# EAGLE design M_B_adapter-tssop (EAGLE 9.6.2)
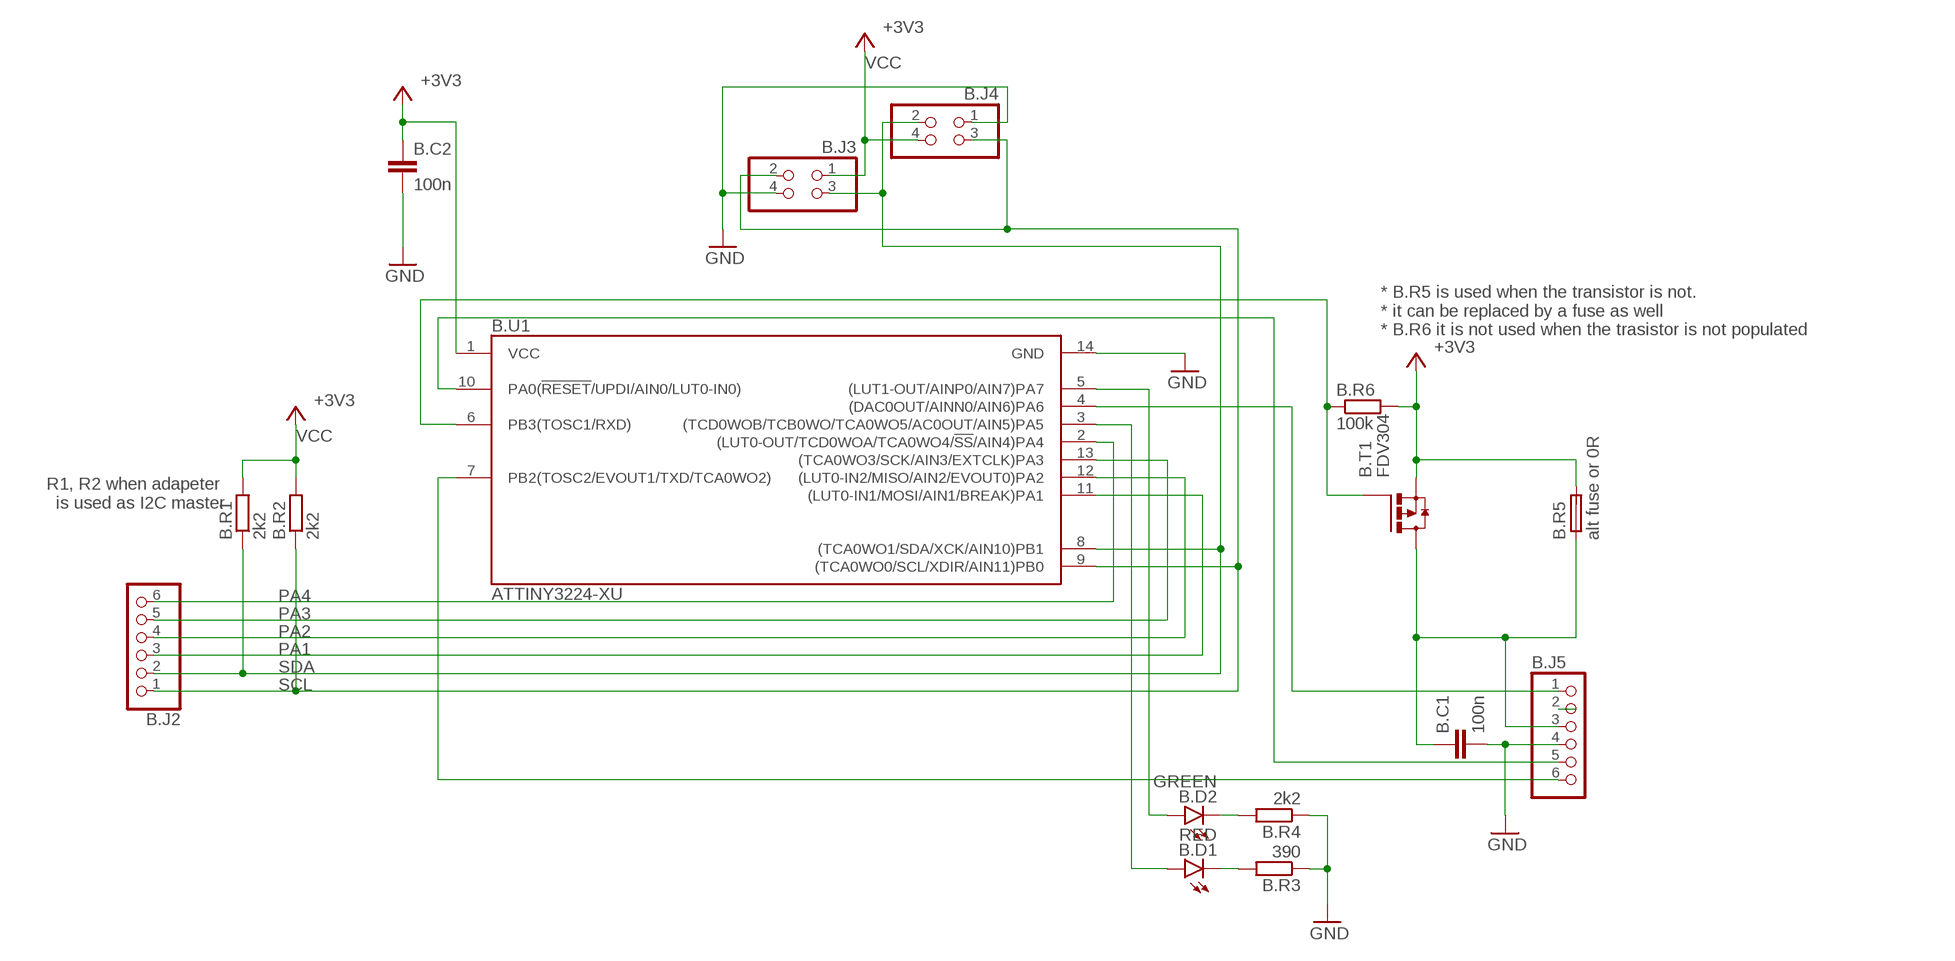
[diagram p0: schematic, sheet 1]

## Parts
B.C1  100n  C-EUC0603  [C0603]
B.C2  100n  C-EUC0603  [C0603]
B.D1  RED  LEDCHIP-LED0603  [CHIP-LED0603]
B.D2  GREEN  LEDCHIP-LED0603  [CHIP-LED0603]
B.J2  PINHD-1X6  [1X06]
B.J3  PINHD-2X2  [2X02]
B.J4  PINHD-2X2  [2X02]
B.J5  PINHD-1X6  [1X06]
B.R1  2k2  R-EU_R0603  [R0603]
B.R2  2k2  R-EU_R0603  [R0603]
B.R3  390  R-EU_R0603  [R0603]
B.R4  2k2  R-EU_R0603  [R0603]
B.R5  alt fuse or 0R  FUSE  [FUSE]
B.R6  100k  R-EU_R0603  [R0603]
B.T1  FDV304  P-MOSFET  [SO23]
B.U1  ATTINY3224-XU  [TSSOP14]

## Nets
GND: B.C1.2 B.C2.2 B.J3.4 B.J4.1 B.J5.4 B.R3.1 B.R4.1 B.U1.14(GND)
N$1: B.D2.C1(C) B.R4.2
N$2: B.D1.C1(C) B.R3.2
N$3: B.C1.1 B.J5.3 B.R5.1 B.T1.D
N$5: B.D1.A1(A) B.U1.3((TCD0WOB/TCB0WO/TCA0WO5/AC0OUT/AIN5)PA5)
PA1: B.J2.3 B.U1.11((LUT0-IN1/MOSI/AIN1/BREAK)PA1)
PA2: B.J2.4 B.U1.12((LUT0-IN2/MISO/AIN2/EVOUT0)PA2)
PA3: B.J2.5 B.U1.13((TCA0WO3/SCK/AIN3/EXTCLK)PA3)
PA4: B.J2.6 B.U1.2((LUT0-OUT/TCD0WOA/TCA0WO4/!SS!/AIN4)PA4)
PA6: B.J5.1 B.U1.4((DAC0OUT/AINN0/AIN6)PA6)
PA7: B.D2.A1(A) B.U1.5((LUT1-OUT/AINP0/AIN7)PA7)
PB2: B.J5.6 B.U1.7(PB2(TOSC2/EVOUT1/TXD/TCA0WO2))
PB3: B.R6.1 B.T1.G B.U1.6(PB3(TOSC1/RXD))
SCL: B.J2.1 B.J3.2 B.J4.3 B.R2.1 B.U1.9((TCA0WO0/SCL/XDIR/AIN11)PB0)
SDA: B.J2.2 B.J3.3 B.J4.2 B.R1.1 B.U1.8((TCA0WO1/SDA/XCK/AIN10)PB1)
UPDI: B.J5.5 B.U1.10(PA0(!RESET!/UPDI/AIN0/LUT0-IN0))
VBAT: B.J5.2
VCC: B.C2.1 B.J3.1 B.J4.4 B.R1.2 B.R2.2 B.R5.2 B.R6.2 B.T1.S B.U1.1(VCC) ; supply symbol labelled +3V3

## Notes on the sheet
- * B.R5 is used when the transistor is not. 
  * it can be replaced by a fuse as well
  * B.R6 it is not used when the trasistor is not populated
- R1, R2 when adapeter 
  is used as I2C master

## Library data of the parts
B.C1 B.C2 = rcl:C-EU: CAPACITOR, European symbol; SPICEPREFIX: C
B.D1 B.D2 = led:LED: LED OSRAM: - CHIPLED LG R971, LG N971, LY N971, LG Q971, LY Q971, LO R971, LY R971 LH N974, LH R974 LS Q976, LO Q976, LY Q976 LO Q996 - Hyper CHIPLED LW Q18S LB Q993, LB Q99A, LB R99A - SideLED LS A670, LO A670, LY A670, LG A670, LP A670 LB A673, LV A673, LT A673, LW A673 LH A674 LY A675 LS A676, LA A676, LO A676, LY A676, LW A676 LS A679, LY A679, LG A679 - Hyper Micro SIDELED® LS Y876, LA Y876, LO Y876, LY Y876 LT Y87S - SmartLED LW L88C, LW L88S LB L89C, LB L89S, LG L890 LS L89K, LO L89K, LY L89K LS L896, LA L896, LO L896, LY L896 - TOPLED LS T670, LO T670, LY T670, LG T670, LP T670 LSG T670, LSP T670, LSY T670, LOP T670, LYG T670 LG T671, LOG T671, LSG T671 LB T673, LV T673, LT T673, LW T673 LH T674 LS T676, LA T676, LO T676, LY T676, LB T676, LH T676, LSB T676, LW T676 LB T67C, LV T67C, LT T67C, LS T67K, LO T67K, LY T67K, LW E67C LS E67B, LA E67B, LO E67B, LY E67B, LB E67C, LV E67C, LT E67C LW T67C LS T679, LY T679, LG T679 LS T770, LO T770, LY T770, LG T770, LP T770 LB T773, LV T773, LT T773, LW T773 LH T774 LS E675, LA E675, LY E675, LS T675 LS T776, LA T776, LO T776, LY T776, LB T776 LHGB T686 LT T68C, LB T68C - Hyper Mini TOPLED® LB M676 - Mini TOPLED Santana® LG M470 LS M47K, LO M47K, LY M47K Source: http://www.osram.convergy.de LUXEON: - LUMILED® LXK2-PW12-R00, LXK2-PW12-S00, LXK2-PW14-U00, LXK2-PW14-V00 LXK2-PM12-R00, LXK2-PM12-S00, LXK2-PM14-U00 LXK2-PE12-Q00, LXK2-PE12-R00, LXK2-PE12-S00, LXK2-PE14-T00, LXK2-PE14-U00 LXK2-PB12-K00, LXK2-PB12-L00, LXK2-PB12-M00, LXK2-PB14-N00, LXK2-PB14-P00, LXK2-PB14-Q00 LXK2-PR12-L00, LXK2-PR12-M00, LXK2-PR14-Q00, LXK2-PR14-R00 LXK2-PD12-Q00, LXK2-PD12-R00, LXK2-PD12-S00 LXK2-PH12-R00, LXK2-PH12-S00 LXK2-PL12-P00, LXK2-PL12-Q00, LXK2-PL12-R00 Source: www.luxeon.com KINGBRIGHT: KA-3528ASYC Source: www.kingbright.com
B.J2 B.J5 = pinhead2:PINHD-1X6: PIN HEADER
B.J3 B.J4 = pinhead2:PINHD-2X2: PIN HEADER
B.R1-B.R4 B.R6 = rcl:R-EU_: RESISTOR, European symbol; SPICEPREFIX: R
B.R5 = hugo:FUSE
B.T1 = hugo:P-MOSFET
B.U1 = ATTINY412-SSN:ATTINY3224-XU

## Board
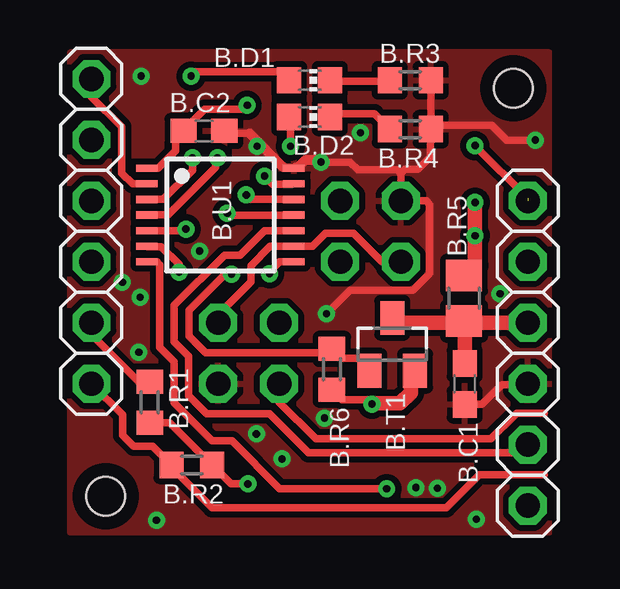
[diagram p1: board, top side]
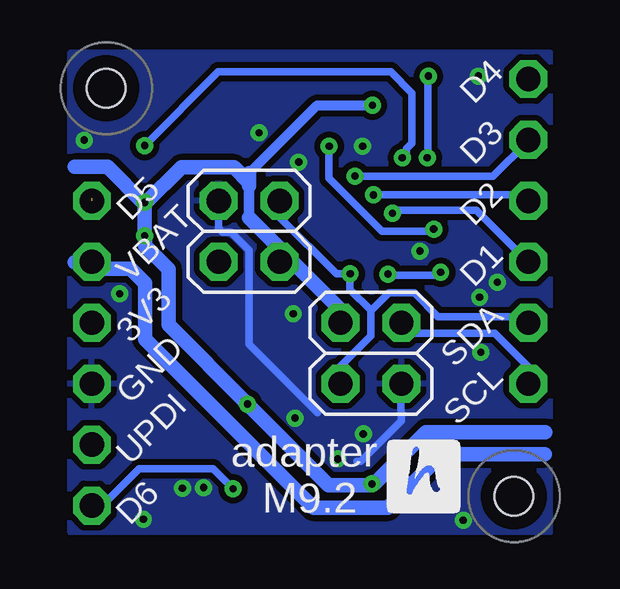
[diagram p2: board, bottom side, seen from below]

No outline drawn. Coordinates in mm, seen from the top.
Copper layers (1*16): Top 0.035mm / dielectric 1.5mm / Bottom 0.035mm
Design rules "default *": minimum track width 10mil, minimum drill 0.3mm, track to track 10mil, track to pad 10mil, pad to pad 10mil, via to via 10mil, smd to smd 10mil, copper to edge 15mil, drill to drill 6mil, minimum pad ring 10mil, minimum via ring 8mil, stop-mask expansion 4mil, vias tented up to drill 14mil, thermal gap 10mil
Holes 1.6 mm at 2,2 19,19
tRestrict: area 18,18 to 20,20; area 1,1 to 3,3
bRestrict: area 18,18 to 20,20; area 1,1 to 3,3

### Footprints (pad centres in the part's own frame; a part is rotated, then mirrored left to right if it is on the bottom)
C0603 = smd 1.1 x 1: 1 -0.85,0; 2 0.85,0
CHIP-LED0603 = smd 1.1 x 1: A1 0,-0.85; C1 0,0.85
1X06 = drill 1.016 pad 1.575 octagon: 1 -6.35,0; 2 -3.81,0; 3 -1.27,0; 4 1.27,0; 5 3.81,0; 6 6.35,0
2X02 = drill 1.016 pad 1.575 octagon: 1 -1.27,-1.27; 2 -1.27,1.27; 3 1.27,-1.27; 4 1.27,1.27
R0603 = smd 1 x 1.1: 1 -0.85,0; 2 0.85,0
FUSE = smd 1.3 x 1.5: 1 -0.95,0; 2 0.95,0
SO23 = smd 1 x 1.4: D 0,1.1; G -0.95,-1.1; S 0.95,-1.1
TSSOP14 = smd 0.3 x 0.9: 1 -1.95,-3.06; 2 -1.3,-3.06; 3 -0.65,-3.06; 4 0,-3.06; 5 0.65,-3.06; 6 1.3,-3.06; 7 1.95,-3.06; 8 1.95,3.06; 9 1.3,3.06; 10 0.65,3.06; 11 0,3.06; 12 -0.65,3.06; 13 -1.3,3.06; 14 -1.95,3.06

### Placement (x,y rotation side)
B.C1  16.97,6.68 270 top
B.C2  6.1,17.22 0 top
B.D1  10.5,19.33 270 top
B.D2  10.5,17.81 270 top
B.J2  1.4,13.04 90 top
B.J3  7.96,7.96 270 bottom
B.J4  13.04,13.04 270 bottom
B.J5  19.6,7.96 270 top
B.R1  3.84,5.92 270 top
B.R2  5.59,3.3 0 top
B.R3  14.7,19.33 180 top
B.R4  14.7,17.3 180 top
B.R5  16.94,10.25 90 top
B.R6  11.43,7.29 270 top
B.T1  13.94,8.33 0 top
B.U1  6.78,13.72 270 top

### Tracks (layer width: path | path; a pad name or v marks a point on that pad's centre or on a via)
GND  (via drill 0.3)
  Top 0.305: v10.97,15.93 12.19,15.93 12.51,15.61 14.16,15.61 14.31,15.45 | 14.31,15.45 B.J4.1 15.36,14.31 15.5,14.17 15.5,11.28 14.8,10.58 12.18,10.58 v11.2,9.6 | 10.06,15.74 9.92,15.74 B.U1.14 9.67,15.72 9.4,15.72 | 8,17.12 7.05,17.12 B.C2.2 | 19.88,16.84 v19.91,16.84 18.72,16.84 18.1,17.46 15.6,17.46 | 15.88,16.95 B.R4.1 | B.R4.1 15.55,17.32 B.R3.1 | B.C1.2 17.69,5.83 18.52,6.66 19.57,6.66 | 14.31,15.45 14.48,15.62 15.01,15.62 15.53,16.14 B.R4.1
  Top 0.406: 10.06,15.74 10.31,15.99 10.91,15.99 | 9.4,15.72 8,17.12
  Top 0.508: v10.97,15.93 10.91,15.99
  Bottom 0.305: B.J3.4 6.69,5.95 6.7,5.94 6.7,5.14 8.38,3.45 8.55,3.45 | 10.19,5.49 13.04,8.34 13.04,12.26 13.79,13.01 14.15,13.01 14.31,13.17 B.J4.1
  other vias: 3.48,19.51 4.11,1 12.62,17.14 18.44,10.44 17.45,1.04 5.92,12.22 8.28,4.6 14.94,2.36 3.43,10.29 3.38,8 11.13,5.26 15.82,2.34 9.35,3.56 2.69,10.92 8.31,16.59
  pour Bottom (isolate 0.254): 0.5,20.5 0.5,0.5 20.5,0.5 20.5,20.5
  pour Top (isolate 0.254): 0.5,20.5 0.5,0.5 20.5,0.5 20.5,20.5
N$1
  Top 0.305: B.R4.2 13.2,17.93 11.48,17.93 B.D2.C1
N$2
  Top 0.305: B.R3.2 13.8,19.28 11.4,19.28 B.D1.C1
N$3
  Top 0.305: B.R5.1 16.94,9.23
  Top 0.508: 16.94,7.56 B.C1.1
  Top 0.61: B.T1.D 14.15,9.22 16.87,9.22 B.R5.1 16.97,9.28 | 16.97,9.28 B.C1.1 | B.J5.3 17.01,9.23 16.97,9.28
N$5  (via drill 0.3)
  Top 0.305: v5.61,16.1 5.61,15.58 4.4,14.37 B.U1.3 | B.D1.A1 9.3,19.68 5.74,19.68 v5.56,19.51
  Bottom 0.305: v5.56,19.51 5.59,19.48 5.59,16.18 v5.61,16.1
PA1  (via drill 0.3)
  Top 0.305: B.U1.11 7.14,13.72 v7.07,13.79
  Bottom 0.305: v7.07,13.79 6.94,13.92 3.57,13.92 1.42,11.77 B.J2.3
PA2  (via drill 0.3)
  Top 0.305: B.U1.12 8.05,14.37 v7.86,14.55
  Bottom 0.305: B.J2.4 1.64,14.55 v7.86,14.55
PA3  (via drill 0.3)
  Top 0.305: B.U1.13 9.77,15.01 8.96,15.01 v8.62,15.34
  Bottom 0.305: B.J2.5 1.4,16.8 2.88,15.32 8.61,15.32 v8.62,15.34
PA4
  Top 0.305: B.U1.2 3.12,15.02 2.67,15.47 2.67,17.39 1.4,18.65 B.J2.6
PA6  (via drill 0.3)  (1 unrouted)
  Top 0.305: v6.66,16.1 6.58,16.1 6.58,15.7 4.61,13.73 3.74,13.73 B.U1.4 | v17.4,16.61 19.6,14.41
  Bottom 0.305: v6.66,16.1 6.48,16.28 6.48,16.48 6.25,16.71 6.25,18.8 7.14,19.68 14.33,19.68 v17.4,16.61
PA7  (via drill 0.3)
  Top 0.305: B.U1.5 5.27,13.07 v5.34,13.13 | B.D2.A1 9.7,17.75 v9.7,16.59
  Bottom 0.305: v5.34,13.13 5.44,13.03 7.5,13.03 9.7,15.24 v9.7,16.59
PB2  (via drill 0.3)
  Top 0.305: v13.72,2.31 9.26,2.31 7.26,4.31 6.43,4.31 4.85,5.89 4.85,7.61 4.25,8.21 4.25,11.65 4.13,11.77 B.U1.7
  Bottom 0.305: v13.72,2.31 14.55,3.15 17.63,3.15 19.17,1.61 B.J5.6
PB3  (via drill 0.3)
  Top 0.305: v7.25,11.26 6.98,11.26 5.47,9.75 5.47,8.67 6.16,7.99 11.28,7.99 B.R6.1 11.81,7.76 12.54,7.76 12.99,7.31 B.T1.G | B.U1.6 3.74,12.4 4.31,12.4 5.05,11.66 v5.05,11.34
  Bottom 0.305: v5.05,11.34 5.18,11.21 7.12,11.21 7.17,11.26 v7.25,11.26
SCL
  Top 0.305: 1.38,6.67 B.J2.1 2.7,5.39 2.7,4.55 3.16,4.09 3.95,4.09 B.R2.1 | B.R2.1 | B.J4.3 13.52,11.77 12.33,12.96 11.16,12.96 10.62,12.42 B.U1.9 8.86,12.42 8.05,11.61 8.05,10.93 6.69,9.57 B.J3.2 | 20.3,2.9 20.29,2.9 17.59,2.9 16.21,1.52 6.43,1.52 5.02,2.93 5.02,3.3 B.R2.1
  Bottom 0.305: B.J2.1 1.4,7.4 2.8,8.8 6.23,8.8 6.67,9.23 B.J3.2
SDA  (via drill 0.3)
  Top 0.305: B.U1.8 9.25,11.77 8.83,11.34 v8.83,11.27 | B.J2.2 1.4,8.75 3.38,6.77 B.R1.1 | 20.3,5.46 19.14,5.46 18.07,4.39 10.76,4.39 9.23,5.92 B.J3.3
  Bottom 0.305: B.J2.2 1.65,9.48 5.16,9.48 6.15,10.47 7.21,10.47 7.96,9.72 | B.J3.3 9.23,7.43 7.96,8.7 7.96,9.72 | B.J4.2 11.77,13.63 9.4,11.27 v8.83,11.27 8.83,10.61 7.96,9.75 7.96,9.72
UPDI
  Top 0.305: B.U1.10 8.62,13.07 7.61,12.05 6.95,12.05 4.86,9.97 4.86,8.44 5.46,7.84 5.46,6.18 6.2,5.45 8.83,5.45 10.46,3.82 18.92,3.82 19.25,4.15 B.J5.5
VBAT
  Bottom 0.61: 0.71,3.76 5.01,3.76 7.24,1.53 10.36,1.53 17.38,8.54 17.38,10.87 17.99,11.48 19.32,11.48 B.J5.2 19.62,11.76 20.32,11.76
VCC  (via drill 0.3)
  Top 0.305: B.R2.2 6.62,3.3 | 16.99,11.25 B.R5.2 | v13.11,5.84 13.11,6.02 11.85,6.02 B.R6.2 | v7.9,18.29 7.75,18.14 6.12,18.14 5.25,17.26 B.C2.1 4.91,16.88 4.91,16.39 4.18,15.67 B.U1.1 | v7.92,2.52 7.22,2.52 B.R2.2 | B.R2.2 4.67,5.07 B.R1.2
  Top 0.508: 16.59,10.85 B.R5.2
  Top 0.61: B.R5.2 16.99,11.2 17.39,11.61 v17.4,12.85 v17.39,14.23 v17.4,14.24 | B.T1.S 14.72,7.05 14.72,6.31 14.28,5.87 13.13,5.87 v13.11,5.84
  Bottom 0.406: v7.9,18.29 10.21,18.29 13.04,15.46
  Bottom 0.44: 13.04,13.6 13.04,14.95
  Bottom 0.61: B.J3.1 9.23,9.76 11.24,11.77 B.J4.4 11.77,12.33 13.04,13.6 | 13.04,14.95 13.04,15.07 | 13.04,15.07 13.04,15.46 | 0.7,4.67 5.66,4.67 7.82,2.52 v7.92,2.52 7.98,2.46 9.73,2.46 v13.11,5.84 16.41,9.14 16.41,11.46 17.38,12.43 v17.4,12.85 17.39,14.17 18.95,15.72 20.32,15.72 | 13.04,15.07 13.68,15.71 15.87,15.71 17.37,14.21 v17.4,14.24

### Text on the board
bPlace: D4 | D3 | D2 | D1 | D5 | VBAT | SDA | SCL | 3V3 | GND | adapter / M9.2 | UPDI | D6
tDocu: ~ SS PA4 | ~ SCK PA3 | ^ RXD' MISO PA2 | PA6 ^ DAC | TXD' MOSI PA1 | VBAT | SDA | 3V3 | SCL | GND | UPDI | PB2 ^~